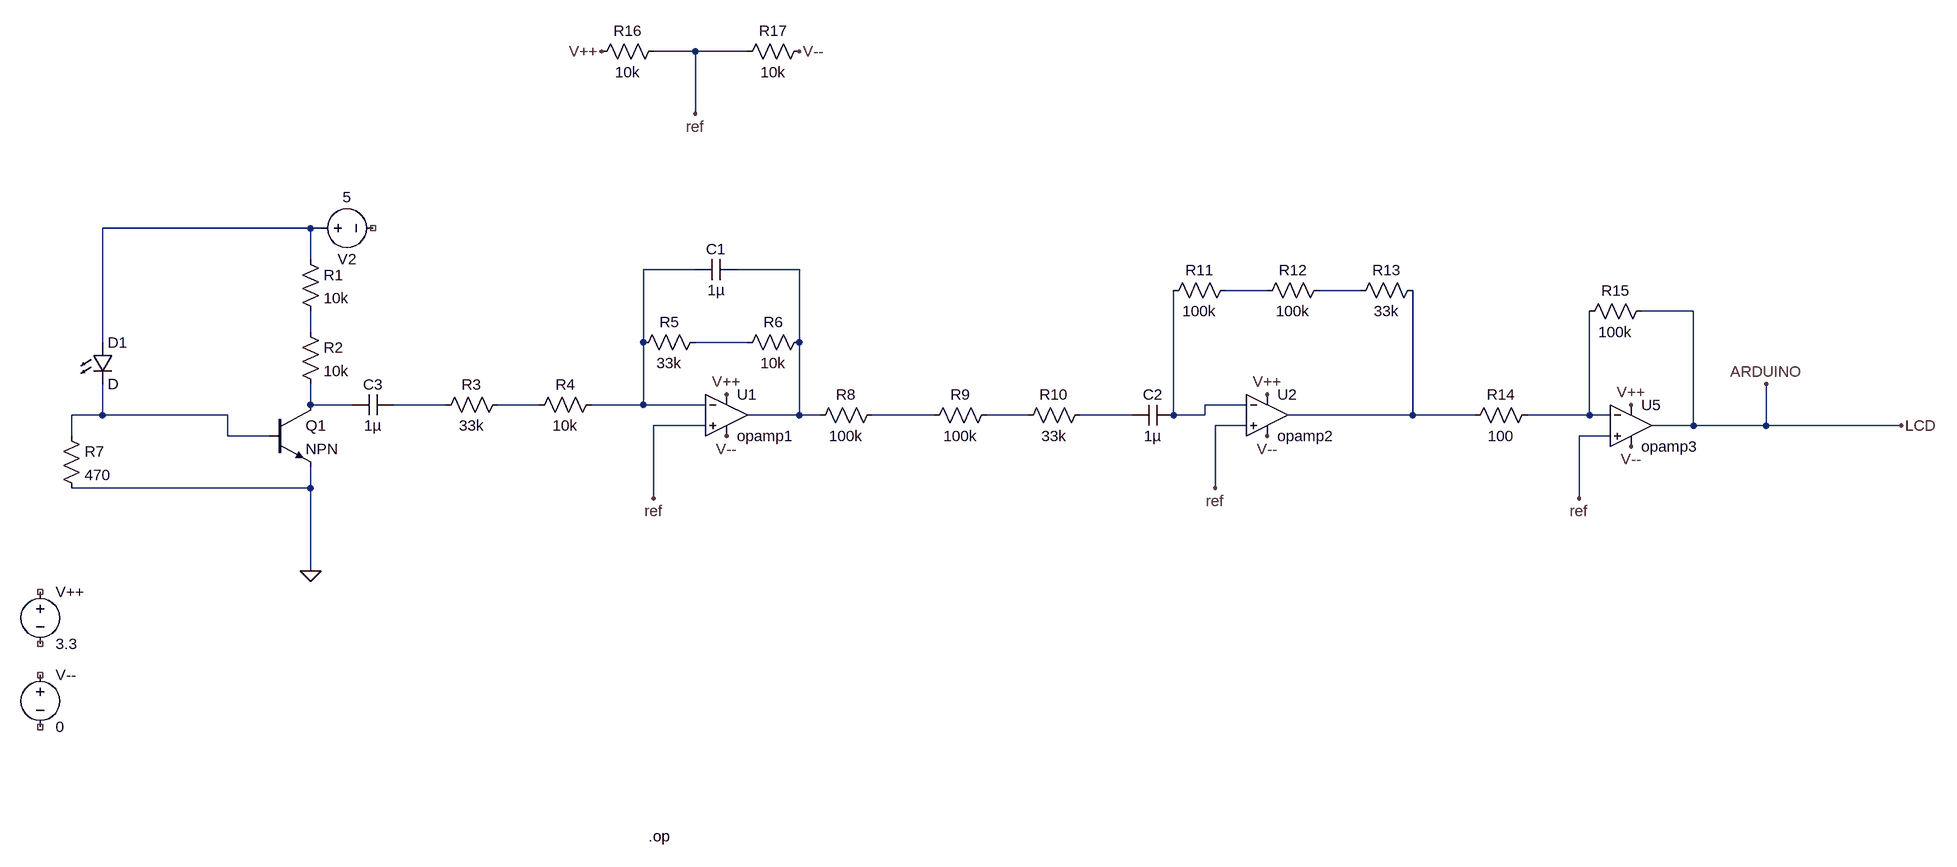
[diagram p0: schematic finalproject-1.asc]
finalproject-1.asc, the LTspice schematic file:
Version 4
SHEET 1 2084 836
WIRE 96 -560 32 -560
WIRE 176 -560 96 -560
WIRE 96 -464 96 -560
WIRE -496 -288 -816 -288
WIRE -480 -288 -496 -288
WIRE -496 -240 -496 -288
WIRE 96 -224 16 -224
WIRE 256 -224 160 -224
WIRE 976 -192 912 -192
WIRE 1120 -192 1056 -192
WIRE 1632 -160 1552 -160
WIRE -496 -128 -496 -160
WIRE -816 -112 -816 -288
WIRE 16 -112 16 -224
WIRE 176 -112 96 -112
WIRE 256 -112 256 -224
WIRE -496 -16 -496 -48
WIRE -432 -16 -496 -16
WIRE -288 -16 -368 -16
WIRE -144 -16 -208 -16
WIRE 16 -16 16 -112
WIRE 16 -16 -64 -16
WIRE 112 -16 16 -16
WIRE 944 -16 880 -16
WIRE -816 0 -816 -48
WIRE -816 0 -864 0
WIRE -624 0 -816 0
WIRE 256 0 256 -112
WIRE 256 0 176 0
WIRE 288 0 256 0
WIRE 464 0 368 0
WIRE 608 0 544 0
WIRE 768 0 688 0
WIRE 832 0 832 -192
WIRE 880 0 880 -16
WIRE 880 0 832 0
WIRE 1200 0 1200 -192
WIRE 1200 0 1008 0
WIRE 1296 0 1200 0
WIRE 1472 0 1472 -160
WIRE 1472 0 1376 0
WIRE 1504 0 1472 0
WIRE 112 16 32 16
WIRE 944 16 896 16
WIRE 1632 16 1632 -160
WIRE 1632 16 1568 16
WIRE 1744 16 1744 -48
WIRE 1744 16 1632 16
WIRE 1952 16 1744 16
WIRE -864 32 -864 0
WIRE -624 32 -624 0
WIRE -560 32 -624 32
WIRE 1504 32 1456 32
WIRE -496 112 -496 80
WIRE -496 112 -864 112
WIRE 896 112 896 16
WIRE 32 128 32 16
WIRE 1456 128 1456 32
WIRE -496 240 -496 112
FLAG 1536 -16 V++
FLAG 1536 48 V--
FLAG -496 240 0
FLAG 1744 -48 ARDUINO
FLAG 144 -32 V++
FLAG 976 -32 V++
FLAG 976 32 V--
FLAG 144 32 V--
FLAG -48 -560 V++
FLAG 256 -560 V--
FLAG 96 -464 ref
FLAG 32 128 ref
FLAG 896 112 ref
FLAG 1456 128 ref
FLAG 1952 16 LCD
SYMBOL OpAmps\\opamp2 1536 -48 R0
SYMATTR InstName U5
SYMATTR Value opamp3
SYMBOL LED -832 -112 R0
SYMATTR InstName D1
SYMBOL npn3 -560 -16 R0
SYMATTR InstName Q1
SYMBOL res -880 16 R0
SYMATTR InstName R7
SYMATTR Value 470
SYMBOL voltage -496 -288 R270
WINDOW 0 -32 56 VBottom 2
WINDOW 3 32 56 VTop 2
WINDOW 123 0 0 Left 0
WINDOW 39 0 0 Left 0
SYMATTR InstName V2
SYMATTR Value 5
SYMBOL voltage -912 256 R0
WINDOW 123 0 0 Left 0
WINDOW 39 0 0 Left 0
SYMATTR InstName V++
SYMATTR Value 3.3
SYMBOL voltage -912 384 R0
WINDOW 123 0 0 Left 0
WINDOW 39 0 0 Left 0
SYMATTR InstName V--
SYMATTR Value 0
SYMBOL res -512 -256 R0
SYMATTR InstName R1
SYMATTR Value 10k
SYMBOL res -512 -144 R0
SYMATTR InstName R2
SYMATTR Value 10k
SYMBOL res -192 -32 R90
WINDOW 0 0 56 VBottom 2
WINDOW 3 32 56 VTop 2
SYMATTR InstName R3
SYMATTR Value 33k
SYMBOL res -48 -32 R90
WINDOW 0 0 56 VBottom 2
WINDOW 3 32 56 VTop 2
SYMATTR InstName R4
SYMATTR Value 10k
SYMBOL res 112 -128 R90
WINDOW 0 0 56 VBottom 2
WINDOW 3 32 56 VTop 2
SYMATTR InstName R5
SYMATTR Value 33k
SYMBOL res 272 -128 R90
WINDOW 0 0 56 VBottom 2
WINDOW 3 32 56 VTop 2
SYMATTR InstName R6
SYMATTR Value 10k
SYMBOL OpAmps\\opamp2 144 -64 R0
SYMATTR InstName U1
SYMATTR Value opamp1
SYMBOL OpAmps\\opamp2 976 -64 R0
SYMATTR InstName U2
SYMBOL cap 160 -240 R90
WINDOW 0 0 32 VBottom 2
WINDOW 3 32 32 VTop 2
SYMATTR InstName C1
SYMATTR Value 1µ
SYMBOL cap 832 -16 R90
WINDOW 0 0 32 VBottom 2
WINDOW 3 32 32 VTop 2
SYMATTR InstName C2
SYMATTR Value 1µ
SYMBOL res 384 -16 R90
WINDOW 0 0 56 VBottom 2
WINDOW 3 32 56 VTop 2
SYMATTR InstName R8
SYMATTR Value 100k
SYMBOL res 560 -16 R90
WINDOW 0 0 56 VBottom 2
WINDOW 3 32 56 VTop 2
SYMATTR InstName R9
SYMATTR Value 100k
SYMBOL res 704 -16 R90
WINDOW 0 0 56 VBottom 2
WINDOW 3 32 56 VTop 2
SYMATTR InstName R10
SYMATTR Value 33k
SYMBOL res 928 -208 R90
WINDOW 0 0 56 VBottom 2
WINDOW 3 32 56 VTop 2
SYMATTR InstName R11
SYMATTR Value 100k
SYMBOL res 1072 -208 R90
WINDOW 0 0 56 VBottom 2
WINDOW 3 32 56 VTop 2
SYMATTR InstName R12
SYMATTR Value 100k
SYMBOL res 1216 -208 R90
WINDOW 0 0 56 VBottom 2
WINDOW 3 32 56 VTop 2
SYMATTR InstName R13
SYMATTR Value 33k
SYMBOL res 1392 -16 R90
WINDOW 0 0 56 VBottom 2
WINDOW 3 32 56 VTop 2
SYMATTR InstName R14
SYMATTR Value 100
SYMBOL res 1568 -176 R90
WINDOW 0 0 56 VBottom 2
WINDOW 3 32 56 VTop 2
SYMATTR InstName R15
SYMATTR Value 100k
SYMBOL res 48 -576 R90
WINDOW 0 0 56 VBottom 2
WINDOW 3 32 56 VTop 2
SYMATTR InstName R16
SYMATTR Value 10k
SYMBOL res 272 -576 R90
WINDOW 0 0 56 VBottom 2
WINDOW 3 32 56 VTop 2
SYMATTR InstName R17
SYMATTR Value 10k
SYMBOL cap -368 -32 R90
WINDOW 0 0 32 VBottom 2
WINDOW 3 32 32 VTop 2
SYMATTR InstName C3
SYMATTR Value 1µ
TEXT 24 648 Left 2 !.op

The netlist it stands for:
* finalproject-1.asc
XU5 ref N017 V++ V-- LCD opamp3  ; pins In+ In- V+ V- OUT
D1 N001 N012 D
Q1 N008 N012 0 0 NPN
R7 N012 0 470
V2 N001 NC_01 5
V++ NC_02 NC_03 3.3
V-- NC_04 NC_05 0
R1 N001 N006 10k
R2 N006 N008 10k
R3 N010 N009 33k
R4 N002 N010 10k
R5 N007 N002 33k
R6 N003 N007 10k
XU1 ref N002 V++ V-- N003 opamp1  ; pins In+ In- V+ V- OUT
XU2 ref N011 V++ V-- N016 opamp2  ; pins In+ In- V+ V- OUT
C1 N003 N002 1µ
C2 N011 N015 1µ
R8 N013 N003 100k
R9 N014 N013 100k
R10 N015 N014 33k
R11 N004 N011 100k
R12 N005 N004 100k
R13 N016 N005 33k
R14 N017 N016 100
R15 LCD N017 100k
R16 ref V++ 10k
R17 V-- ref 10k
C3 N009 N008 1µ
.model D D
.lib standard.dio
.model NPN NPN
.model PNP PNP
.lib standard.bjt
.op
.backanno
.end